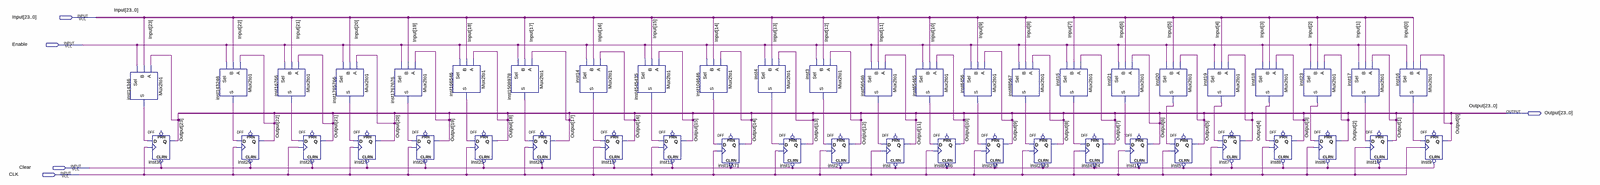
[diagram p0: schematic sheet, whole]
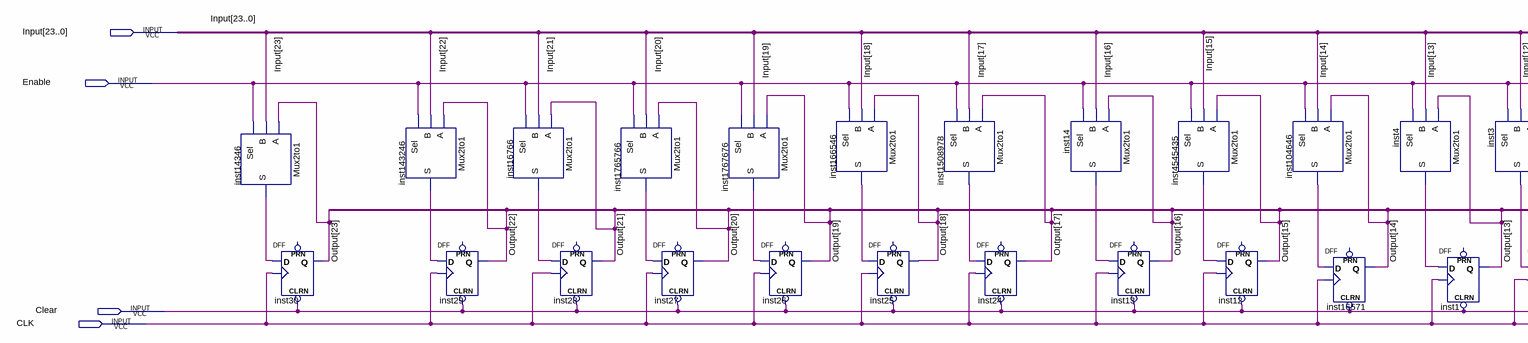
[diagram p1: schematic sheet, left part]
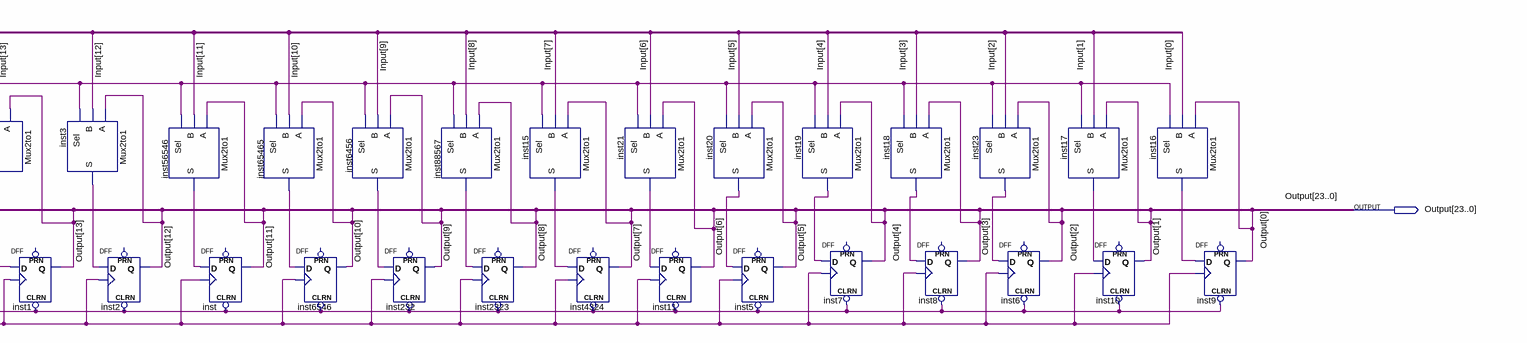
[diagram p2: schematic sheet, right part]
// Quartus schematic INST.bdf as structural Verilog: 48 symbols, 5 pins
module INST (
  input  [23:0] Input,
  input  Enable,
  input  Clear,
  input  CLK,
  output [23:0] Output
);

  wire inst3_s, inst4_s, inst14_s, inst15_s, inst16_s, inst17_s, inst18_s, inst19_s, inst20_s, inst21_s,
       inst23_s, inst6456_s, inst14346_s, inst16766_s, inst56546_s, inst65465_s, inst88567_s, inst104646_s,
       inst143246_s, inst166546_s, inst1508978_s, inst1765766_s, inst1767676_s, inst4545435_s;

  Mux2to1 inst14346 (.A(Output[23]), .B(Input[23]), .Sel(Enable), .S(inst14346_s));
  DFF inst30 (.CLRN(Clear), .CLK(CLK), .D(inst14346_s), .Q(Output[23]));  // open: PRN
  Mux2to1 inst143246 (.A(Output[22]), .B(Input[22]), .Sel(Enable), .S(inst143246_s));
  DFF inst29 (.CLRN(Clear), .CLK(CLK), .D(inst143246_s), .Q(Output[22]));  // open: PRN
  Mux2to1 inst16766 (.A(Output[21]), .B(Input[21]), .Sel(Enable), .S(inst16766_s));
  DFF inst28 (.CLRN(Clear), .CLK(CLK), .D(inst16766_s), .Q(Output[21]));  // open: PRN
  Mux2to1 inst1765766 (.A(Output[20]), .B(Input[20]), .Sel(Enable), .S(inst1765766_s));
  DFF inst27 (.CLRN(Clear), .CLK(CLK), .D(inst1765766_s), .Q(Output[20]));  // open: PRN
  Mux2to1 inst1767676 (.A(Output[19]), .B(Input[19]), .Sel(Enable), .S(inst1767676_s));
  DFF inst26 (.CLRN(Clear), .CLK(CLK), .D(inst1767676_s), .Q(Output[19]));  // open: PRN
  Mux2to1 inst166546 (.A(Output[18]), .B(Input[18]), .Sel(Enable), .S(inst166546_s));
  DFF inst25 (.CLRN(Clear), .CLK(CLK), .D(inst166546_s), .Q(Output[18]));  // open: PRN
  Mux2to1 inst1508978 (.A(Output[17]), .B(Input[17]), .Sel(Enable), .S(inst1508978_s));
  DFF inst24 (.CLRN(Clear), .CLK(CLK), .D(inst1508978_s), .Q(Output[17]));  // open: PRN
  Mux2to1 inst14 (.A(Output[16]), .B(Input[16]), .Sel(Enable), .S(inst14_s));
  DFF inst13 (.CLRN(Clear), .CLK(CLK), .D(inst14_s), .Q(Output[16]));  // open: PRN
  Mux2to1 inst4545435 (.A(Output[15]), .B(Input[15]), .Sel(Enable), .S(inst4545435_s));
  DFF inst12 (.CLRN(Clear), .CLK(CLK), .D(inst4545435_s), .Q(Output[15]));  // open: PRN
  Mux2to1 inst104646 (.A(Output[14]), .B(Input[14]), .Sel(Enable), .S(inst104646_s));
  DFF inst16571 (.CLRN(Clear), .CLK(CLK), .D(inst104646_s), .Q(Output[14]));  // open: PRN
  Mux2to1 inst4 (.A(Output[13]), .B(Input[13]), .Sel(Enable), .S(inst4_s));
  DFF inst1 (.CLRN(Clear), .CLK(CLK), .D(inst4_s), .Q(Output[13]));  // open: PRN
  Mux2to1 inst3 (.A(Output[12]), .B(Input[12]), .Sel(Enable), .S(inst3_s));
  DFF inst2 (.CLRN(Clear), .CLK(CLK), .D(inst3_s), .Q(Output[12]));  // open: PRN
  Mux2to1 inst56546 (.A(Output[11]), .B(Input[11]), .Sel(Enable), .S(inst56546_s));
  DFF inst (.CLRN(Clear), .CLK(CLK), .D(inst56546_s), .Q(Output[11]));  // open: PRN
  Mux2to1 inst65465 (.A(Output[10]), .B(Input[10]), .Sel(Enable), .S(inst65465_s));
  Mux2to1 inst6456 (.A(Output[9]), .B(Input[9]), .Sel(Enable), .S(inst6456_s));
  DFF inst6546 (.CLRN(Clear), .CLK(CLK), .D(inst65465_s), .Q(Output[10]));  // open: PRN
  DFF inst232 (.CLRN(Clear), .CLK(CLK), .D(inst6456_s), .Q(Output[9]));  // open: PRN
  Mux2to1 inst88567 (.A(Output[8]), .B(Input[8]), .Sel(Enable), .S(inst88567_s));
  DFF inst2323 (.CLRN(Clear), .CLK(CLK), .D(inst88567_s), .Q(Output[8]));  // open: PRN
  Mux2to1 inst15 (.A(Output[7]), .B(Input[7]), .Sel(Enable), .S(inst15_s));
  DFF inst4324 (.CLRN(Clear), .CLK(CLK), .D(inst15_s), .Q(Output[7]));  // open: PRN
  Mux2to1 inst21 (.A(Output[6]), .B(Input[6]), .Sel(Enable), .S(inst21_s));
  DFF inst11 (.CLRN(Clear), .CLK(CLK), .D(inst21_s), .Q(Output[6]));  // open: PRN
  Mux2to1 inst20 (.A(Output[5]), .B(Input[5]), .Sel(Enable), .S(inst20_s));
  DFF inst5 (.CLRN(Clear), .CLK(CLK), .D(inst20_s), .Q(Output[5]));  // open: PRN
  Mux2to1 inst19 (.A(Output[4]), .B(Input[4]), .Sel(Enable), .S(inst19_s));
  DFF inst7 (.CLRN(Clear), .CLK(CLK), .D(inst19_s), .Q(Output[4]));  // open: PRN
  Mux2to1 inst18 (.A(Output[3]), .B(Input[3]), .Sel(Enable), .S(inst18_s));
  DFF inst8 (.CLRN(Clear), .CLK(CLK), .D(inst18_s), .Q(Output[3]));  // open: PRN
  Mux2to1 inst23 (.A(Output[2]), .B(Input[2]), .Sel(Enable), .S(inst23_s));
  DFF inst6 (.CLRN(Clear), .CLK(CLK), .D(inst23_s), .Q(Output[2]));  // open: PRN
  Mux2to1 inst17 (.A(Output[1]), .B(Input[1]), .Sel(Enable), .S(inst17_s));
  DFF inst10 (.CLRN(Clear), .CLK(CLK), .D(inst17_s), .Q(Output[1]));  // open: PRN
  Mux2to1 inst16 (.A(Output[0]), .B(Input[0]), .Sel(Enable), .S(inst16_s));
  DFF inst9 (.CLRN(Clear), .CLK(CLK), .D(inst16_s), .Q(Output[0]));  // open: PRN
endmodule
